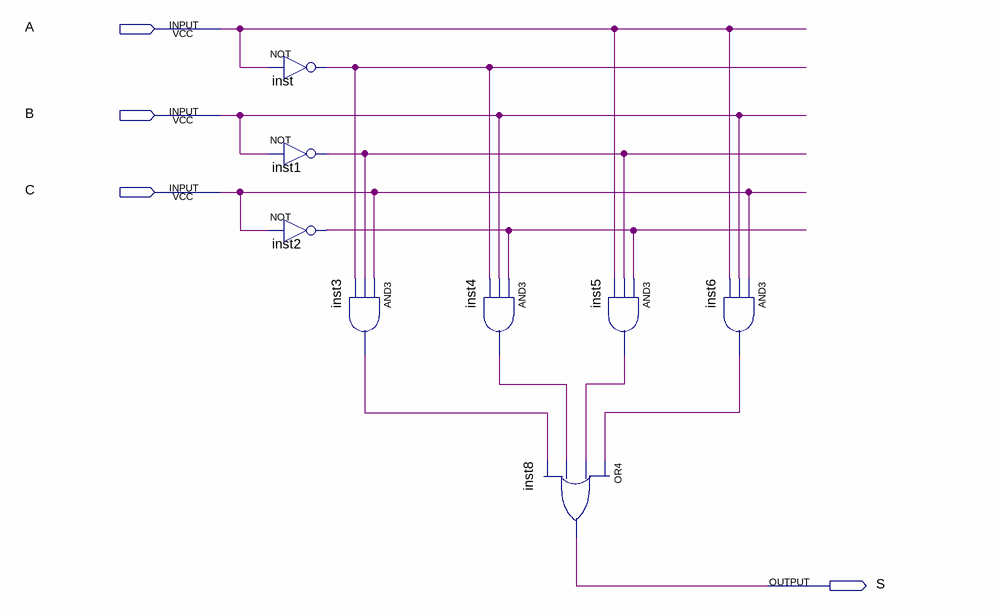
[diagram p0: schematic sheet]
// Quartus schematic Cuito_S.bdf as structural Verilog: 8 symbols, 4 pins
module Cuito_S (
  input  A,
  input  B,
  input  C,
  output S
);

  wire inst1_out, inst2_out, inst3_out, inst4_out, inst5_out, inst6_out, inst_out;

  not inst (inst_out, A);
  not inst1 (inst1_out, B);
  not inst2 (inst2_out, C);
  and inst3 (inst3_out, C, inst1_out, inst_out);
  and inst4 (inst4_out, inst2_out, B, inst_out);
  or inst8 (S, inst6_out, inst5_out, inst4_out, inst3_out);
  and inst5 (inst5_out, inst2_out, inst1_out, A);
  and inst6 (inst6_out, C, B, A);
endmodule
